# Altium schematic sheet [3]SENSOR.SchDoc
size A
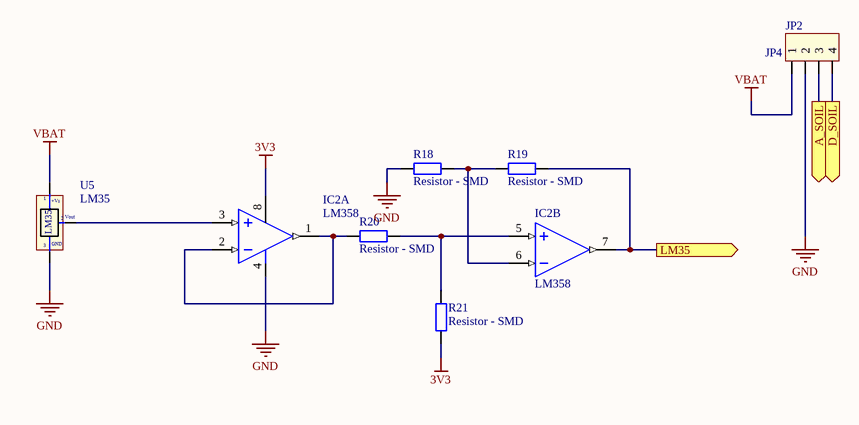
[diagram p0: [3]SENSOR.SchDoc]

## Parts
IC2  LM358  [DIP8/W0.3]  (parts A,B of 2)
JP2  JP4  [CON4]
R18  Resistor - SMD  [RES_SMD_0805]
R19  Resistor - SMD  [RES_SMD_0805]
R20  Resistor - SMD  [RES_SMD_0805]
R21  Resistor - SMD  [RES_SMD_0805]
U5  LM35  [QTO-92]

## Ports
A_SOIL (out), D_SOIL (out), LM35 (out)

## Nets
3V3: IC2.8(+V) R21.2
GND: IC2.4(-V) JP2.2 R18.1 U5.3(-)
VBAT: JP2.1 U5.1(+Vs)
A_SOIL: JP2.3 ; port A_SOIL
D_SOIL: JP2.4 ; port D_SOIL
LM35: IC2.7(OUT) R19.2 ; port LM35
NetIC2_1: IC2.1(OUT) IC2.2(IN-) R20.2
NetIC2_3: IC2.3(IN+) U5.2(Vout)
NetIC2_5: IC2.5(IN+) R20.1 R21.1
NetIC2_6: IC2.6(IN-) R18.2 R19.1

## Notes on the sheet
- (in symbol LM35) GND

## Library data of the parts
IC2 = LM358: Low-Power Dual Operational Amplifier; Value: LM358
JP2 = Con4: Connector 4; Value: Connector 4
R18-R21 = Resistor - SMD: Resistor SMD; Manufacturer: Generic Components; Class: Passive; Published: 08/06/2000; Publisher: Altium Hobart Technology Centre
U5 = LM35: Teminal; Value: LM35